# EAGLE design crowlar (EAGLE 8.0.0)
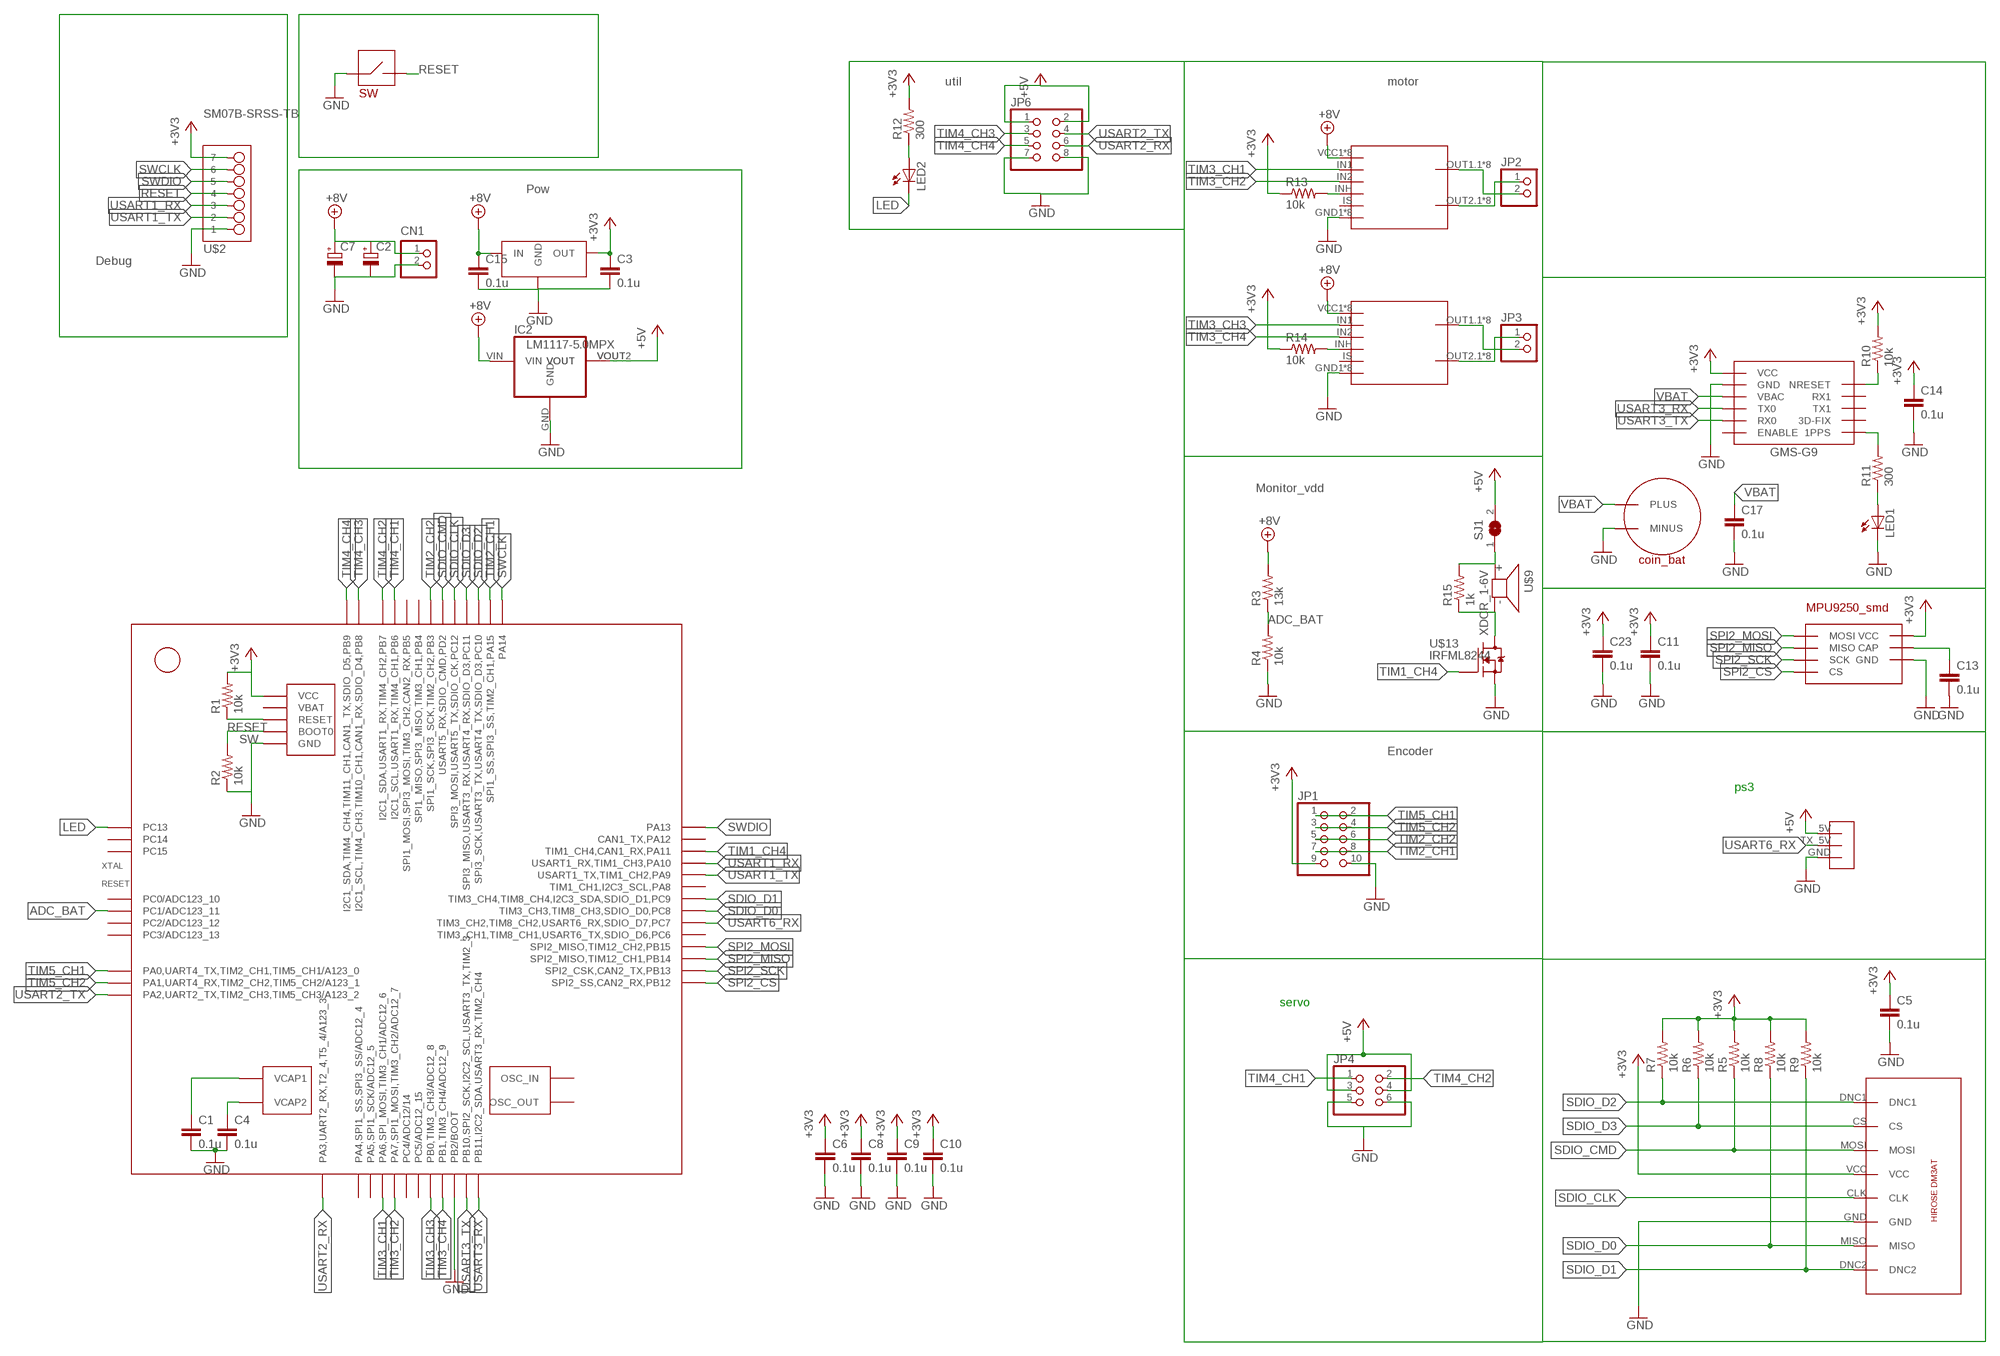
[diagram p0: schematic, sheet 1]

## Parts
C1  0.1u  C-EUC0603K  [C0603K]
C2  CPOL-EU153CLV-0605  [153CLV-0605]
C3  0.1u  C-EUC0603K  [C0603K]
C4  0.1u  C-EUC0603K  [C0603K]
C5  0.1u  C-EUC0603K  [C0603K]
C6  0.1u  C-EUC0603K  [C0603K]
C7  CPOL-EU153CLV-0605  [153CLV-0605]
C8  0.1u  C-EUC0603K  [C0603K]
C9  0.1u  C-EUC0603K  [C0603K]
C10  0.1u  C-EUC0603K  [C0603K]
C11  0.1u  C-EUC0603K  [C0603K]
C13  0.1u  C-EUC0603K  [C0603K]
C14  0.1u  C-EUC0603K  [C0603K]
C15  0.1u  C-EUC0603K  [C0603K]
C17  0.1u  C-EUC0603K  [C0603K]
C23  0.1u  C-EUC0603K  [C0603K]
CN1  S2B-XASK-1  [S2B-XASK-1]
IC2  LM1117-5.0MPX  LM1117-5.0IMP  [SOT223]
JP1  PINHD-2X5/90  [2X05/90]
JP2  PINHD-1X2/90  [1X02/90]
JP3  PINHD-1X2/90  [1X02/90]
JP4  PINHD-2X3/90  [2X03/90]
JP6  PINHD-2X4/90  [2X04/90]
LED1  LEDCHIP-LED0603  [CHIP-LED0603]
LED2  LEDCHIP-LED0603  [CHIP-LED0603]
R1  10k  R-US_R0603  [R0603]
R2  10k  R-US_R0603  [R0603]
R3  13k  R-US_R0603  [R0603]
R4  10k  R-US_R0603  [R0603]
R5  10k  R-US_R0603  [R0603]
R6  10k  R-US_R0603  [R0603]
R7  10k  R-US_R0603  [R0603]
R8  10k  R-US_R0603  [R0603]
R9  10k  R-US_R0603  [R0603]
R10  10k  R-US_R0603  [R0603]
R11  300  R-US_R0603  [R0603]
R12  300  R-US_R0603  [R0603]
R13  10k  R-US_R0603  [R0603]
R14  10k  R-US_R0603  [R0603]
R15  1k  R-US_R0603  [R0603]
SJ1  SJ  [SJ]
STM32F405RGT6  STM32F405_T  [LQFP64]
U$1  GMS-G9  [GMS-G9]
U$2  SM07B-SRSS-TB  [SM07B-SRSS-TB]
U$3  SBDBT_5V  [SBDBT_5V]
U$4  BTM7752  [BTM7752]
U$5  DM3AT  [DM3AT]
U$6  SWTVBP06-B043CB-B  [SW]
U$8  AP7361-33E  [SOT223]
U$9  XDCR_1-6V  [XDCR_1-6V]
U$10  36-3030-ND  [36-3030-ND]
U$11  BTM7752  [BTM7752]
U$13  IRFML8244  [SOT23]
U$16  MPU9250_SMD  [MPU9250_SMD]

## Nets
+3V3: C3.1 C5.1 C6.1 C8.1 C9.1 C10.1 C11.1 C14.1 C23.1 JP1.9 R1.2 R5.2 R6.2 R7.2 R8.2 R9.2 R10.2 R12.2 R13.1 R14.1 STM32F405RGT6.13(VCC) STM32F405RGT6.19(VCC) STM32F405RGT6.32(VCC) STM32F405RGT6.48(VCC) STM32F405RGT6.64(VCC) U$1.VCC U$2.P$7 U$5.VCC U$8.OUT U$16.RESV(VCC) U$16.VDD(VCC) U$16.VDDIO(VCC)
+5V [VCC]: IC2.VOUT IC2.VOUT2(VOUT) JP4.3 JP4.4 JP6.1 JP6.2 SJ1.2 U$3.5V
+8V: C2.+ C7.+ C15.1 CN1.1 IC2.VIN R3.2 U$4.VCC1(VCC) U$4.VCC2(VCC) U$4.VCC3(VCC) U$4.VCC4(VCC) U$4.VCC5(VCC) U$4.VCC6(VCC) U$4.VCC7(VCC) U$4.VCC8(VCC) U$8.IN U$11.VCC1(VCC) U$11.VCC2(VCC) U$11.VCC3(VCC) U$11.VCC4(VCC) U$11.VCC5(VCC) U$11.VCC6(VCC) U$11.VCC7(VCC) U$11.VCC8(VCC)
ADC_BAT: R3.1 R4.2 STM32F405RGT6.9(PC1/ADC123_11)
GND: C1.2 C2.- C3.2 C4.2 C5.2 C6.2 C7.- C8.2 C9.2 C10.2 C11.2 C13.2 C14.2 C15.2 C17.2 C23.2 CN1.2 IC2.GND JP1.10 JP4.5 JP4.6 JP6.7 JP6.8 LED1.C R2.1 R4.1 STM32F405RGT6.12(GND) STM32F405RGT6.18(GND) STM32F405RGT6.28(PB2/BOOT) STM32F405RGT6.63(GND) U$1.GND U$1.GND1(GND) U$2.P$1 U$3.GND U$4.GND1(GND) U$4.GND2(GND) U$4.GND3(GND) U$4.GND4(GND) U$4.GND5(GND) U$4.GND6(GND) U$4.GND7(GND) U$4.GND8(GND) U$5.GND U$6.P$1 U$8.GND1(GND) U$8.GND2(GND) U$10.MINUS U$11.GND1(GND) U$11.GND2(GND) U$11.GND3(GND) U$11.GND4(GND) U$11.GND5(GND) U$11.GND6(GND) U$11.GND7(GND) U$11.GND8(GND) U$13.2(S) U$16.GND U$16.~RESV(GND)
LED: LED2.C STM32F405RGT6.2(PC13)
N$1: JP2.1 U$4.OUT2.1(OUT2) U$4.OUT2.2(OUT2) U$4.OUT2.3(OUT2) U$4.OUT2.4(OUT2) U$4.OUT2.5(OUT2) U$4.OUT2.6(OUT2) U$4.OUT2.7(OUT2) U$4.OUT2.8(OUT2)
N$2: R14.2 U$11.INH
N$3: R13.2 U$4.INH
N$4: JP2.2 U$4.OUT1.1(OUT1) U$4.OUT1.2(OUT1) U$4.OUT1.3(OUT1) U$4.OUT1.4(OUT1) U$4.OUT1.5(OUT1) U$4.OUT1.6(OUT1) U$4.OUT1.7(OUT1) U$4.OUT1.8(OUT1)
N$5: C4.1 STM32F405RGT6.47(VCAP2)
N$6: C1.1 STM32F405RGT6.31(VCAP1)
N$7: R15.2 SJ1.1 U$9.PLUS
N$8: R15.1 U$9.MINUS U$13.3(D)
N$9: JP3.2 U$11.OUT1.1(OUT1) U$11.OUT1.2(OUT1) U$11.OUT1.3(OUT1) U$11.OUT1.4(OUT1) U$11.OUT1.5(OUT1) U$11.OUT1.6(OUT1) U$11.OUT1.7(OUT1) U$11.OUT1.8(OUT1)
N$10: R10.1 U$1.NRESET
N$11: R11.2 U$1.1PPS
N$12: LED1.A R11.1
N$16: LED2.A R12.1
N$17: JP3.1 U$11.OUT2.1(OUT2) U$11.OUT2.2(OUT2) U$11.OUT2.3(OUT2) U$11.OUT2.4(OUT2) U$11.OUT2.5(OUT2) U$11.OUT2.6(OUT2) U$11.OUT2.7(OUT2) U$11.OUT2.8(OUT2)
N$23: C13.1 U$16.REGOUT(CAP)
RESET: R1.1 STM32F405RGT6.7(RESET) U$2.P$4 U$6.P$2
SDIO_CLK: STM32F405RGT6.53(SPI3_MOSI,USART5_TX,SDIO_CK,PC12) U$5.CLK
SDIO_CMD: R5.1 STM32F405RGT6.54(USART5_RX,SDIO_CMD,PD2) U$5.MOSI
SDIO_D0: R8.1 STM32F405RGT6.39(TIM3_CH3,TIM8_CH3,SDIO_D0,PC8) U$5.MISO
SDIO_D1: R9.1 STM32F405RGT6.40(TIM3_CH4,TIM8_CH4,I2C3_SDA,SDIO_D1,PC9) U$5.DNC2
SDIO_D2: R7.1 STM32F405RGT6.51(SPI3_SCK,USART3_TX,USART4_TX,SDIO_D3,PC10) U$5.DNC1
SDIO_D3: R6.1 STM32F405RGT6.52(SPI3_MISO,USART3_RX,USART4_RX,SDIO_D3,PC11) U$5.CS
SPI2_CS: STM32F405RGT6.33(SPI2_SS,CAN2_RX,PB12) U$16.CS
SPI2_MISO: STM32F405RGT6.35(SPI2_MISO,TIM12_CH1,PB14) U$16.MISO
SPI2_MOSI: STM32F405RGT6.36(SPI2_MISO,TIM12_CH2,PB15) U$16.MOSI
SPI2_SCK: STM32F405RGT6.34(SPI2_CSK,CAN2_TX,PB13) U$16.SCK
SW: R2.2 STM32F405RGT6.60(BOOT0)
SWCLK: STM32F405RGT6.49(PA14) U$2.P$6
SWDIO: STM32F405RGT6.46(PA13) U$2.P$5
TIM1_CH4: STM32F405RGT6.44(TIM1_CH4,CAN1_RX,PA11) U$13.1(G)
TIM2_CH1: JP1.7 JP1.8 STM32F405RGT6.50(SPI1_SS,SPI3_SS,TIM2_CH1,PA15)
TIM2_CH2: JP1.5 JP1.6 STM32F405RGT6.55(SPI1_SCK,SPI3_SCK,TIM2_CH2,PB3)
TIM3_CH1: STM32F405RGT6.22(PA6,SPI_MOSI,TIM3_CH1/ADC12_6) U$4.IN1
TIM3_CH2: STM32F405RGT6.23(PA7,SPI1_MOSI,TIM3_CH2/ADC12_7) U$4.IN2
TIM3_CH3: STM32F405RGT6.26(PB0,TIM3_CH3/ADC12_8) U$11.IN1
TIM3_CH4: STM32F405RGT6.27(PB1,TIM3_CH4/ADC12_9) U$11.IN2
TIM4_CH1: JP4.1 STM32F405RGT6.58(I2C1_SCL,USART1_RX,TIM4_CH1,PB6)
TIM4_CH2: JP4.2 STM32F405RGT6.59(I2C1_SDA,USART1_RX,TIM4_CH2,PB7)
TIM4_CH3: JP6.3 STM32F405RGT6.61(I2C1_SCL,TIM4_CH3,TIM10_CH1,CAN1_RX,SDIO_D4,PB8)
TIM4_CH4: JP6.5 STM32F405RGT6.62(I2C1_SDA,TIM4_CH4,TIM11_CH1,CAN1_TX,SDIO_D5,PB9)
TIM5_CH1: JP1.1 JP1.2 STM32F405RGT6.14(PA0,UART4_TX,TIM2_CH1,TIM5_CH1/A123_0)
TIM5_CH2: JP1.3 JP1.4 STM32F405RGT6.15(PA1,UART4_RX,TIM2_CH2,TIM5_CH2/A123_1)
USART1_RX: STM32F405RGT6.43(USART1_RX,TIM1_CH3,PA10) U$2.P$3
USART1_TX: STM32F405RGT6.42(USART1_TX,TIM1_CH2,PA9) U$2.P$2
USART2_RX: JP6.6 STM32F405RGT6.17(PA3,UART2_RX,T2_4,T5_4/A123_3)
USART2_TX: JP6.4 STM32F405RGT6.16(PA2,UART2_TX,TIM2_CH3,TIM5_CH3/A123_2)
USART3_RX: STM32F405RGT6.30(PB11,I2C2_SDA,USART3_RX,TIM2_CH4) U$1.TX0
USART3_TX: STM32F405RGT6.29(PB10,SPI2_SCK,I2C2_SCL,USART3_TX,TIM2_3) U$1.RX0
USART6_RX: STM32F405RGT6.38(TIM3_CH2,TIM8_CH2,USART6_RX,SDIO_D7,PC7) U$3.TX_5V
VBAT: C17.1 U$1.VBAC U$10.PLUS1(PLUS) U$10.PLUS2(PLUS)
Unconnected: STM32F405RGT6.1(VBAT) STM32F405RGT6.3(PC14) STM32F405RGT6.4(PC15) STM32F405RGT6.5(OSC_IN) STM32F405RGT6.6(OSC_OUT) STM32F405RGT6.8(PC0/ADC123_10) STM32F405RGT6.10(PC2/ADC123_12) STM32F405RGT6.11(PC3/ADC123_13) STM32F405RGT6.20(PA4,SPI1_SS,SPI3_SS/ADC12_4) STM32F405RGT6.21(PA5,SPI1_SCK/ADC12_5) STM32F405RGT6.24(PC4/ADC12/14) STM32F405RGT6.25(PC5/ADC12_15) STM32F405RGT6.37(TIM3_CH1,TIM8_CH1,USART6_TX,SDIO_D6,PC6) STM32F405RGT6.41(TIM1_CH1,I2C3_SCL,PA8) STM32F405RGT6.45(CAN1_TX,PA12) STM32F405RGT6.56(SPI1_MISO,SPI3_MISO,TIM3_CH1,PB4) STM32F405RGT6.57(SPI1_MOSI,SPI3_MOSI,TIM3_CH2,CAN2_RX,PB5) U$1.3D-FIX U$1.ENABLE U$1.RX1 U$1.TX1 U$4.IS U$11.IS

## Notes on the sheet
- util | motor
- Pow
- Debug
- Monitor_vdd
- Encoder
- ps3
- servo

## Library data of the parts
C1 C3-C6 C8-C11 C13-C15 C17 C23 = resistor:C-EU: CAPACITOR, European symbol
C2 C7 = rcl:CPOL-EU: POLARIZED CAPACITOR, European symbol
CN1 = jst-xa:S2B-XASK-1: Wire-to-Board 2.5mm pitch top mount connector Source: http://www.jst-mfg.com/product/pdf/jpn/XA1.pdf http://www.jst-mfg.com/product/detail.php?series=272
IC2 = Regulator:LM1117: 800mA and 1A Low Dropout (LDO) Positive Regulator 1.8V, 2.5V, 2.85V, 3.3V, 5V, and Adj
JP1 = pinhead:PINHD-2X5: PIN HEADER
JP2 JP3 = pinhead:PINHD-1X2: PIN HEADER
JP4 = pinhead:PINHD-2X3: PIN HEADER
JP6 = pinhead:PINHD-2X4: PIN HEADER
LED1 LED2 = led:LED: LED OSRAM: - CHIPLED LG R971, LG N971, LY N971, LG Q971, LY Q971, LO R971, LY R971 LH N974, LH R974 LS Q976, LO Q976, LY Q976 LO Q996 - Hyper CHIPLED LW Q18S LB Q993, LB Q99A, LB R99A - SideLED LS A670, LO A670, LY A670, LG A670, LP A670 LB A673, LV A673, LT A673, LW A673 LH A674 LY A675 LS A676, LA A676, LO A676, LY A676, LW A676 LS A679, LY A679, LG A679 - Hyper Micro SIDELED® LS Y876, LA Y876, LO Y876, LY Y876 LT Y87S - SmartLED LW L88C, LW L88S LB L89C, LB L89S, LG L890 LS L89K, LO L89K, LY L89K LS L896, LA L896, LO L896, LY L896 - TOPLED LS T670, LO T670, LY T670, LG T670, LP T670 LSG T670, LSP T670, LSY T670, LOP T670, LYG T670 LG T671, LOG T671, LSG T671 LB T673, LV T673, LT T673, LW T673 LH T674 LS T676, LA T676, LO T676, LY T676, LB T676, LH T676, LSB T676, LW T676 LB T67C, LV T67C, LT T67C, LS T67K, LO T67K, LY T67K, LW E67C LS E67B, LA E67B, LO E67B, LY E67B, LB E67C, LV E67C, LT E67C LW T67C LS T679, LY T679, LG T679 LS T770, LO T770, LY T770, LG T770, LP T770 LB T773, LV T773, LT T773, LW T773 LH T774 LS E675, LA E675, LY E675, LS T675 LS T776, LA T776, LO T776, LY T776, LB T776 LHGB T686 LT T68C, LB T68C - Hyper Mini TOPLED® LB M676 - Mini TOPLED Santana® LG M470 LS M47K, LO M47K, LY M47K Source: http://www.osram.convergy.de LUXEON: - LUMILED® LXK2-PW12-R00, LXK2-PW12-S00, LXK2-PW14-U00, LXK2-PW14-V00 LXK2-PM12-R00, LXK2-PM12-S00, LXK2-PM14-U00 LXK2-PE12-Q00, LXK2-PE12-R00, LXK2-PE12-S00, LXK2-PE14-T00, LXK2-PE14-U00 LXK2-PB12-K00, LXK2-PB12-L00, LXK2-PB12-M00, LXK2-PB14-N00, LXK2-PB14-P00, LXK2-PB14-Q00 LXK2-PR12-L00, LXK2-PR12-M00, LXK2-PR14-Q00, LXK2-PR14-R00 LXK2-PD12-Q00, LXK2-PD12-R00, LXK2-PD12-S00 LXK2-PH12-R00, LXK2-PH12-S00 LXK2-PL12-P00, LXK2-PL12-Q00, LXK2-PL12-R00 Source: www.luxeon.com KINGBRIGHT: KA-3528ASYC Source: www.kingbright.com
R1-R15 = resistor:R-US_: RESISTOR, American symbol
SJ1 = jumper:SJ: SMD solder JUMPER
STM32F405RGT6 = stm32f:STM32F405_T
U$1 = GMS-G9:GMS-G9
U$2 = con-jst-sh:SM07B-SRSS-TB
U$3 = SBDBT_5V:SBDBT_5V
U$4 U$11 = BTM7752:BTM7752
U$5 = HIROSE-DM3AT:DM3AT
U$6 = TVBP06-B043CB-B:SW
U$8 = AP7361-33E:AP7361-33E
U$9 = buzzer:XDCR_1-6V
U$10 = 36-3030-ND:36-3030-ND
U$13 = transistor-fet:IRFML8244
U$16 = MPU9250:MPU9250_SMD

## Board
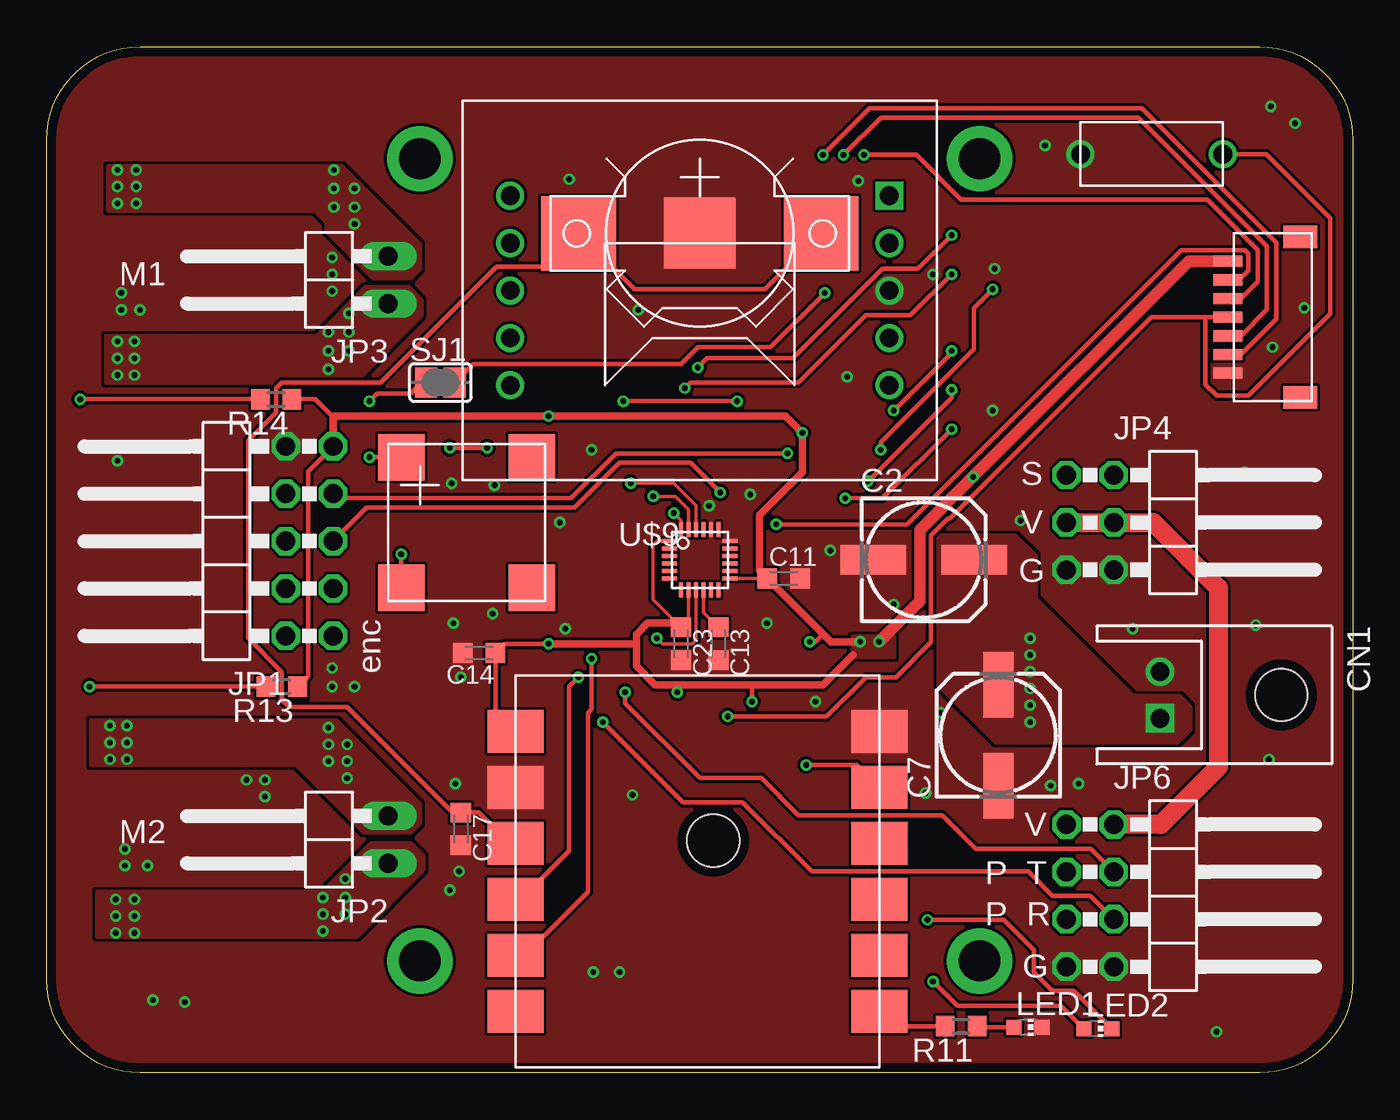
[diagram p1: board, top side]
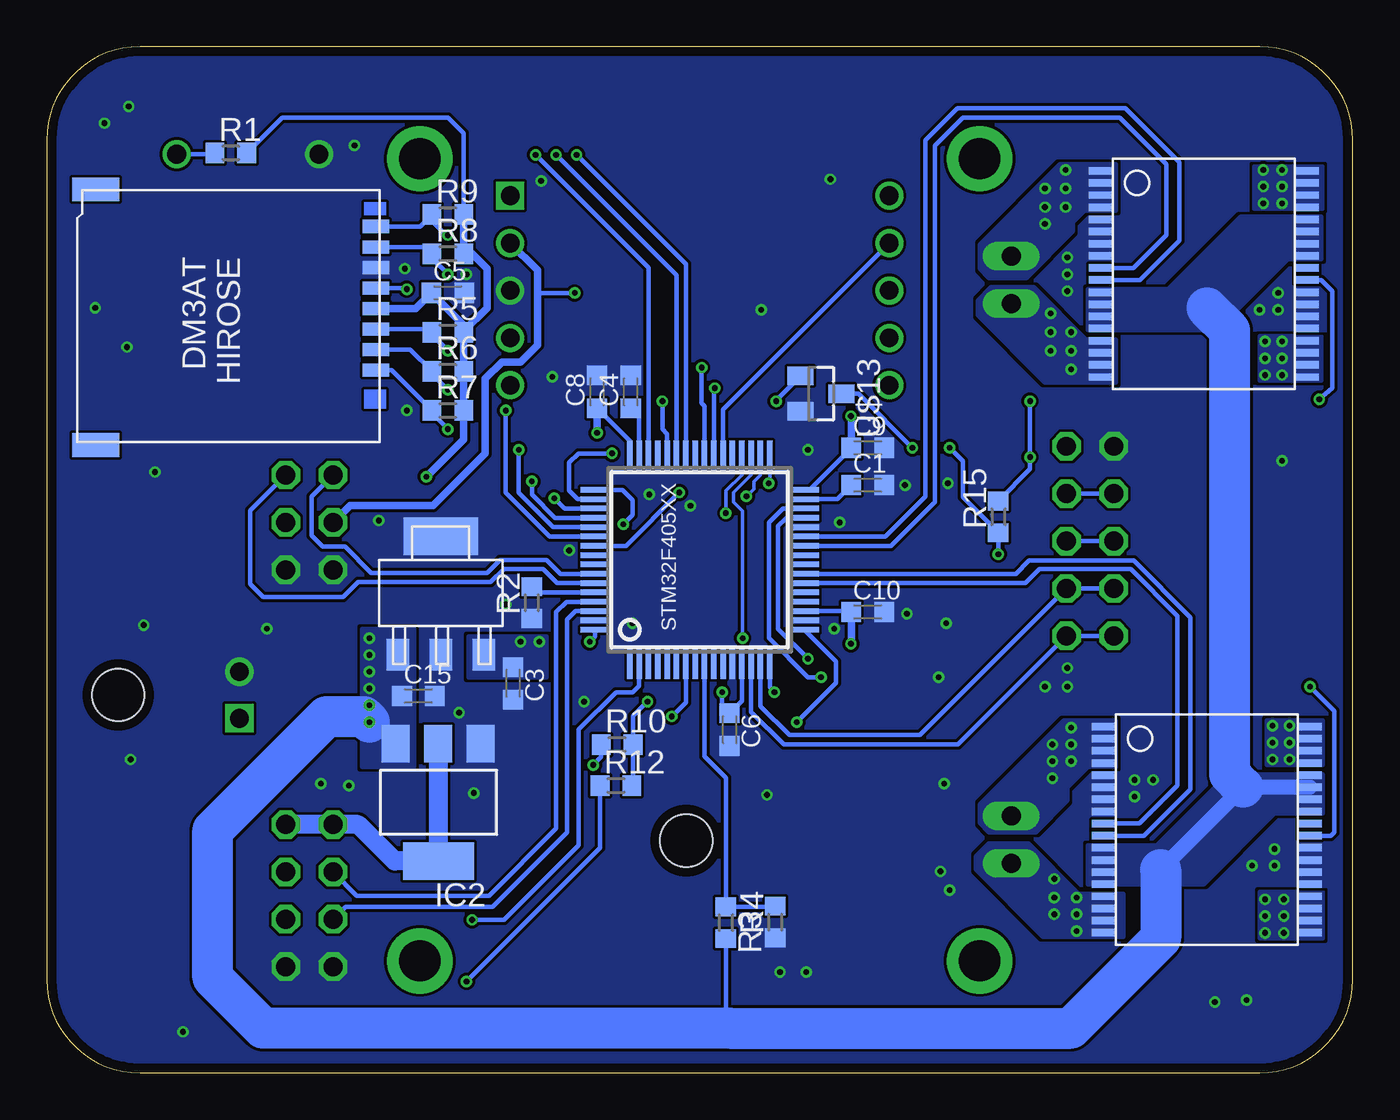
[diagram p2: board, bottom side, seen from below]

Size 70 x 55 mm. Coordinates in mm from the lower left corner, seen from the top.
Outline: 0,50 arc-90 5,55 65,55 arc-90 70,50 70,5 arc-90 65,0 5,0 arc-90 0,5 0,50
Copper layers (1*16): Top 0.035mm / dielectric 1.6mm / Bottom 0.035mm
Design rules "Elecrow_2-layer_PCB_eagle_rule": minimum track width 6mil, minimum drill 12mil, track to track 6mil, track to pad 6mil, pad to pad 6mil, via to via 8mil, smd to smd 0mil, copper to edge 20mil, drill to drill 10mil, minimum pad ring 6mil, minimum via ring 6mil, stop-mask expansion 0mil, vias tented up to drill 100mil, thermal gap 10mil

### Footprints (pad centres in the part's own frame; a part is rotated, then mirrored left to right if it is on the bottom)
C0603K = smd 1.05 x 1.08: 1 -0.875,0; 2 0.875,0
153CLV-0605 = smd 3.5 x 1.6: + 2.7,0; - -2.7,0
S2B-XASK-1 = drill 1.016 square: 1 1.25,0 | drill 1.016: 2 -1.25,0 | hole 2.8: 0,6.5
SOT223 = smd 1.499 x 2.007: GND -2.261,-3.15; VIN 2.311,-3.15; VOUT 0.025,-3.15 | smd 3.81 x 2.007: VOUT2 0,3.15
2X05/90 = drill 1.016 octagon: 1 -5.08,-6.35; 2 -5.08,-3.81; 3 -2.54,-6.35; 4 -2.54,-3.81; 5 0,-6.35; 6 0,-3.81; 7 2.54,-6.35; 8 2.54,-3.81; 9 5.08,-6.35; 10 5.08,-3.81
1X02/90 = drill 1.016 long: 1 -1.27,-3.81; 2 1.27,-3.81
2X03/90 = drill 1.016 octagon: 1 -2.54,-6.35; 2 -2.54,-3.81; 3 0,-6.35; 4 0,-3.81; 5 2.54,-6.35; 6 2.54,-3.81
2X04/90 = drill 1.016 octagon: 1 -3.81,-6.35; 2 -3.81,-3.81; 3 -1.27,-6.35; 4 -1.27,-3.81; 5 1.27,-6.35; 6 1.27,-3.81; 7 3.81,-6.35; 8 3.81,-3.81
CHIP-LED0603 = smd 0.8 x 0.8: A 0,-0.75; C 0,0.75
R0603 = smd 1 x 1.1: 1 -0.85,0; 2 0.85,0
SJ = smd 1.168 x 1.6: 1 -0.762,0; 2 0.762,0
LQFP64 = smd 1.6 x 0.3: 1 -5.6,3.75; 2 -5.6,3.25; 3 -5.6,2.75; 4 -5.6,2.25; 5 -5.6,1.75; 6 -5.6,1.25; 7 -5.6,0.75; 8 -5.6,0.25; 9 -5.6,-0.25; 10 -5.6,-0.75; 11 -5.6,-1.25; 12 -5.6,-1.75; 13 -5.6,-2.25; 14 -5.6,-2.75; 15 -5.6,-3.25; 16 -5.6,-3.75; 33 5.6,-3.75; 34 5.6,-3.25; 35 5.6,-2.75; 36 5.6,-2.25; 37 5.6,-1.75; 38 5.6,-1.25; 39 5.6,-0.75; 40 5.6,-0.25; 41 5.6,0.25; 42 5.6,0.75; 43 5.6,1.25; 44 5.6,1.75; 45 5.6,2.25; 46 5.6,2.75; 47 5.6,3.25; 48 5.6,3.75 | smd 0.3 x 1.6: 17 -3.75,-5.6; 18 -3.25,-5.6; 19 -2.75,-5.6; 20 -2.25,-5.6; 21 -1.75,-5.6; 22 -1.25,-5.6; 23 -0.75,-5.6; 24 -0.25,-5.6; 25 0.25,-5.6; 26 0.75,-5.6; 27 1.25,-5.6; 28 1.75,-5.6; 29 2.25,-5.6; 30 2.75,-5.6; 31 3.25,-5.6; 32 3.75,-5.6; 49 3.75,5.6; 50 3.25,5.6; 51 2.75,5.6; 52 2.25,5.6; 53 1.75,5.6; 54 1.25,5.6; 55 0.75,5.6; 56 0.25,5.6; 57 -0.25,5.6; 58 -0.75,5.6; 59 -1.25,5.6; 60 -1.75,5.6; 61 -2.25,5.6; 62 -2.75,5.6; 63 -3.25,5.6; 64 -3.75,5.6
GMS-G9 = smd 3 x 2.3: 1PPS 9.75,-6; 3D-FIX 9.75,-3; ENABLE -9.75,-6; GND -9.75,6; GND1 9.75,9; NRESET 9.75,6; RX0 -9.75,-3; RX1 9.75,3; TX0 -9.75,0; TX1 9.75,0; VBAC -9.75,3; VCC -9.75,9 | hole 2.8: 0.85,3.15
SM07B-SRSS-TB = smd 0.6 x 1.55: P$1 -3,0; P$2 -2,0; P$3 -1,0; P$4 0,0; P$5 1,0; P$6 2,0; P$7 3,0 | smd 1.2 x 1.8: P$8 -4.3,-3.875; P$9 4.3,-3.875
SBDBT_5V = drill 1 square: 1 10.16,5.08 | drill 1: 4 10.16,-2.54; 5 10.16,-5.08; 5V 10.16,2.54; 6 -10.16,5.08; 8 -10.16,0; 9 -10.16,-2.54; 10 -10.16,-5.08; GND 10.16,0; TX_5V -10.16,2.54
BTM7752 = smd 1.27 x 0.4: GND1 -5.2,3.25; GND2 -5.2,2.6; GND3 -5.2,1.95; GND4 -5.2,1.3; GND5 5.85,-0.65; GND6 5.85,-1.3; GND7 5.85,-1.95; GND8 5.85,-2.6; IN1 -5.2,0.65; IN2 -5.2,0; INH 5.85,0; IS 5.85,0.65; OUT1.1 -5.2,5.85; OUT1.2 -5.2,5.2; OUT1.3 -5.2,4.55; OUT1.4 -5.2,3.9; OUT1.5 5.85,5.85; OUT1.6 5.85,5.2; OUT1.7 5.85,4.55; OUT1.8 5.85,3.9; OUT2.1 -5.2,-3.25; OUT2.2 -5.2,-3.9; OUT2.3 -5.2,-4.55; OUT2.4 -5.2,-5.2; OUT2.5 5.85,-3.25; OUT2.6 5.85,-3.9; OUT2.7 5.85,-4.55; OUT2.8 5.85,-5.2; VCC1 -5.2,-0.65; VCC2 -5.2,-1.3; VCC3 -5.2,-1.95; VCC4 -5.2,-2.6; VCC5 5.85,3.25; VCC6 5.85,2.6; VCC7 5.85,1.95; VCC8 5.85,1.3
DM3AT = smd 0.711 x 1.422: CLK -1.56,6.63; CS 1.74,6.63; DNC1 2.84,6.63; DNC2 -4.86,6.63; GND -2.66,6.63; MISO -3.76,6.63; MOSI 0.64,6.63; VCC -0.46,6.63 | smd 1.27 x 2.54: P$1 6.85,-8.39; P$2 -6.85,-8.39
SW = drill 1: P$1 -3.81,0; P$2 3.81,0
SOT223' = smd 4 x 2: GND1 0,3.81 | smd 1.2 x 1.7: GND2 0,-2.54; IN -2.3,-2.54; OUT 2.3,-2.54
XDCR_1-6V = smd 2.5 x 2.5: MINUS 3.5,3.5; P$1 -3.5,3.5; P$2 -3.5,-3.5; PLUS 3.5,-3.5
36-3030-ND = smd 3.81 x 3.81: MINUS 0,0 | smd 4 x 4: PLUS1 -6.5,0; PLUS2 6.5,0
SOT23 = smd 1 x 1.4: 1 -0.95,-1.1; 2 0.95,-1.1; 3 0,1.1
MPU9250_SMD = smd 0.2 x 0.8: AUX_CL -1,-1.62; AUX_DA 0.2,1.62; CS -0.2,1.62; FSYNC 0.6,-1.62; INT 1,-1.62; MISO -0.2,-1.62; MOSI -1,1.62; NC9 1,1.62; REGOUT 0.2,-1.62; SCK -0.6,1.62; VDDIO -0.6,-1.62; ~RESV 0.6,1.62 | smd 0.8 x 0.2: GND 1.62,1; NC0 -1.62,0.6; NC1 -1.62,0.2; NC2 -1.62,-0.2; NC3 -1.62,-0.6; NC4 -1.62,-1; NC5 1.62,-0.6; NC6 1.62,-0.2; NC7 1.62,0.2; NC8 1.62,0.6; RESV -1.62,1; VDD 1.62,-1

### Placement (x,y rotation side)
C1  26,31.5 0 bottom
C2  47,27.5 0 top
C3  45,20.88 270 bottom
C4  38.7,36.5 90 bottom
C5  48.5,41.8 0 bottom
C6  33.4,18.4 270 bottom
C7  51,18.1 90 top
C8  40.5,36.5 90 bottom
C9  26,33.5 0 bottom
C10  26,24.7 0 bottom
C11  39.5,26.5 0 top
C13  36,23 270 top
C14  23.18,22.5 180 top
C15  50.08,20.2 0 bottom
C17  22.2,13.07 270 top
C23  34,23 270 top
CN1  59.67,20.25 270 top
IC2  49,14.5 180 bottom
JP1  9,28.5 90 top
JP2  14.5,12.5 90 top
JP3  14.5,42.5 90 top
JP4  61,29.5 270 top
JP6  61,9.5 270 top
LED1  52.58,2.45 270 top
LED2  56.33,2.37 270 top
R1  60.13,49.3 0 bottom
R2  44,25.2 90 bottom
R3  33.6,8.05 270 bottom
R4  30.95,8.09 90 bottom
R5  48.5,39.7 0 bottom
R6  48.5,37.6 0 bottom
R7  48.5,35.5 0 bottom
R8  48.5,43.9 0 bottom
R9  48.5,46 0 bottom
R10  39.43,17.6 0 bottom
R11  49.01,2.5 180 top
R12  39.49,15.4 0 bottom
R13  12.6,20.7 180 top
R14  12.3,36.1 180 top
R15  19,29.8 90 bottom
SJ1  21.1,37 0 top
STM32F405RGT6  35,27.5 90 bottom
U$1  34.87,9.3 0 top
U$2  63.31,40.5 90 top
U$3  35,41.93 0 top
U$4  8.15,12.71 0 bottom
U$5  58.98,40.5 270 bottom
U$6  59.22,49.24 0 top
U$8  AP7361-33E  [SOT223']  48.88,24.95 0 bottom
U$9  22.5,29.5 180 top
U$10  35,45 0 top
U$11  8.32,42.49 0 bottom
U$13  28.5,36.4 270 bottom
U$16  35,27.5 0 top

### Tracks (layer width: path | path; a pad name or v marks a point on that pad's centre or on a via)
+3V3  (via drill 0.3)
  Top 0.2: U$16.VDDIO 34.4,24.27 C23.1 32.5,25.38 32.5,28.3 32.7,28.5 U$16.RESV | U$16.VDD C11.1
  Top 0.254: v40.9,23.1 41.2,23.1 41.61,23.51 | R14.1 14.4,36.1 15.35,35.15 | v37.8,19.9 37.8,20.8 | R13.1 14,21.25 14,32.23 JP1.9 | U$1.VCC 24.05,19.37 C14.1 24.55,23 v26.9,23
  Top 0.406: v43.6,23.1 42.02,23.1 41.61,23.51 C11.1 38.2,26.93 38.2,29.9 40.5,32.2 v40.5,34.3 39.6,35.2 v26.9,35.2 15.4,35.2 15.35,35.15 JP1.9 | C23.1 33.77,24.1 32.2,24.1 31.6,23.5 31.6,23.1 | 31.6,23.1 31.6,21.8 32.6,20.8 33.9,20.8 | 43.2,22.4 41.6,20.8 37.8,20.8 33.9,20.8 | v33.8,20.4 33.8,20.7 33.9,20.8 | v26.9,23 31.5,23 31.6,23.1
  Top 0.61: U$2.P$7 61.2,43.5 v49.65,31.95 46.8,29.1 46.8,25.3 v44.6,23.1
  Bottom 0.254: R1.2 57.38,51.2 48.5,51.2 47.65,50.35 R9.2 | STM32F405RGT6.64 40.6,23.4 v40.9,23.1 | C8.1 38.75,33.88 STM32F405RGT6.48 | C9.1 29.12,31.25 STM32F405RGT6.32 | STM32F405RGT6.19 26.93,24.75 C10.1 | R12.2 38.58,15.46 R10.2 38.58,19.12 v37.8,19.9 | v33.8,20.4 33.8,19.68 C6.1 32.75,19.93 STM32F405RGT6.13
  Bottom 0.406: U$5.VCC 50.22,40.96 C5.1 47.65,40.08 R5.2 | R5.2 R6.2 R7.2 47.65,33.95 v49.65,31.95 | R9.2 R8.2 47.2,43.9 46.4,43.1 46.4,41 47.65,39.75 R5.2 | v40.5,34.3 C8.1 | 26.9,33.5 C9.1 26.88,35.17 v26.9,35.2 | C10.1 26.88,23.02 v26.9,23
  pour Bottom (no thermals): 47.4,23.4 47.4,21.2 43.2,21.2 43.2,23.4
  pour Top (no thermals): 43.2,23.4 43.2,22.3 45.4,22.3 45.4,23.4
+5V  (via drill 0.3)
  Top 0.254: SJ1.2 22.86,38 34,38 34.9,38.9 38.8,38.9 v41.7,41.8
  Top 1.016: JP4.3 JP4.4 59.3,29.5 62.8,26 62.8,16.4 59.71,13.31 JP6.2
  Bottom 0.254: v41.7,41.8 43.7,41.8
  Bottom 0.406: U$3.5V 43.7,43.01 43.7,41.8 43.7,39 44.6,38.1 45.6,38.1 46.5,37.2 46.5,33.2 49.3,30.4 53.75,30.4 JP4.3
  Bottom 1.016: IC2.VOUT 49.02,11.22 48.7,10.9 48.7,11.05 IC2.VOUT2 51.35,11.35 53.31,13.31 JP6.1 JP6.2
+8V  (via drill 0.3)
  Bottom 0.254: R3.2 33.6,2.6 33.4,2.4
  Bottom 0.813: U$4.VCC6 5.89,15.31 10.3,10.9
  Bottom 2.184: 10.3,10.9 10.3,7.2 15.1,2.4 33.4,2.4 58.4,2.4 61.1,5.1 61.1,13 55,19.1 53,19.1 v52.7,18.8 | 5.89,15.31 6.6,16.02 6.6,39.8 7.8,41
  other vias: 52.7,23.3 52.7,22.4 52.7,21.5 52.7,20.6 52.7,19.7
  pour Top (no thermals): 47.8,28.8 51.9,28.8 53,27.7 53,25.4 58.2,20.2 60.7,20.2 61.3,19.6 61.3,18.4 60.6,17.7 50.9,17.7 47.8,20.8
  pour Bottom (no thermals): 50.3,23.8 50.3,16.4 53.1,16.4 53.1,23.8
  pour Bottom (no thermals): 1.6,16 6.7,16 10.5,12.2 14.2,12.2 14.2,10.1 8,10.1 4.2,13.9 1.6,13.9
  pour Bottom (no thermals): 1.7,45.9 6,45.9 9.9,42 14.2,42 14.2,39.8 7.3,39.8 3.5,43.6 1.7,43.6
ADC_BAT
  Bottom 0.254: STM32F405RGT6.9 34.75,16.95 33.6,15.8 R3.1 30.99,8.9 R4.2
GND  (via drill 0.3)
  other vias: 31.7,40.9 47.5,42.8 52.2,29.6 42,28 45.4,25.1 38.6,24.1 37.7,31 41.2,19.9 24,31.5 27.5,29.5 21.7,31.6 27.8,23.8 23.9,24.6 21.8,24.1 29.2,33.4 5,40.9 16.5,20.7 15.3,43.7 15.3,42.8 15.3,41.9 4,41.8 4,40.9 3.8,32.8 11.7,15.7 11.7,14.8 10.7,15.7 4.2,12 4.2,11.1 5.4,11.1 5.7,3.9 7.4,3.8 21.6,9.8 22.1,10.8 21.9,15.5 22.2,21.2 29.3,5.4 30.7,5.4 31.4,14.9 62.7,2.2 58.2,23.8 64.8,24 65.5,16.8 55.3,15.5 53.8,15.4 47.1,15 50.7,35.5 64.2,32.2 53.5,49.7 42.9,37.3 35.5,30.4 28,47.9 43.5,47.8 67.4,41 65.7,38.9 50.8,43.1 15.3,20.7 15.3,21.7 47.9,19.3 65.6,51.8 66.9,50.9
  pour Top (rank 6, no thermals): -5,55.5 73,55.5 73,-3.5 -5,-3.5
  pour Bottom (rank 6, no thermals): -9.9,57.7 80.1,57.7 80,-6.5 -10,-6.5
LED  (via drill 0.3)
  Top 0.254: LED2.C 55.05,4.4 53.9,4.4 52.9,5.4 52.9,6.6 51.3,8.2 v47.2,8.2
  Bottom 0.254: v47.2,8.2 45.5,8.2 41.5,12.2 41.5,18.4 39.5,20.4 38.6,20.4 38.25,20.75 STM32F405RGT6.2
N$1  (via drill 0.3)
  other vias: 4.7,9.3 4.7,8.4 4.7,7.5 3.7,9.3 3.7,8.4 3.7,7.5 14.8,9.4 14.8,8.5 14.8,7.6 16,9.4 16,10.4 16,8.5
  pour Bottom (no thermals): 12.3,9.6 14.7,9.6 17.4,12.3 19.5,12.3 20.2,11.6 20.2,10.9 16.6,7.3 12.3,7.3
  pour Bottom (no thermals): 1.6,9.7 5,9.7 5,7.2 1.6,7.2
  pour Top (no thermals): 2.7,9.7 14.8,9.7 17.4,12.3 19.5,12.3 20.2,11.6 20.2,10.9 16.6,7.3 2.7,7.3
N$2  (via drill 0.3)
  Top 0.254: v1.8,36.1 R14.2
  Bottom 0.254: U$11.INH 1.69,42.49 1.1,41.9 1.1,36.7 v1.8,36.1
N$3  (via drill 0.3)
  Top 0.254: v2.3,20.7 R13.2
  Bottom 0.254: U$4.INH 1.19,12.71 1,12.9 1,19.4 v2.3,20.7
N$4  (via drill 0.3)
  other vias: 4.3,18.6 4.3,17.7 4.3,16.8 3.4,18.6 3.4,17.7 3.4,16.8 15.1,18.5 15.1,17.6 15.1,16.7 16.1,17.6 16.1,16.7 16.1,15.8
  pour Bottom (no thermals): 12.7,18.9 15.5,18.9 20,14.4 20,13.4 19.5,12.9 17,12.9 15.3,14.6 15.3,15.3 14.2,16.4 12.7,16.4
  pour Bottom (no thermals): 1.6,18.9 4.6,18.9 4.6,16.5 1.6,16.5
  pour Top: 2.4,18.9 15.5,18.9 15.5,16.5 2.4,16.5
  pour Top (no thermals): 13.2,18.9 15.5,18.9 20,14.4 20,13.4 19.5,12.9 17,12.9 13.2,16.7
N$5
  Bottom 0.254: C4.1 38.25,35.17 STM32F405RGT6.47
N$6
  Bottom 0.254: C1.1 27.62,30.75 STM32F405RGT6.31
N$7  (via drill 0.3)
  Top 0.254: 18.4,33 U$9.PLUS v17.3,33 | v17.3,36 17.7,36.4 19.5,36.4 20.1,37 SJ1.1
  Bottom 0.254: v17.3,36 v17.3,33 17.3,32.35 R15.2
N$8  (via drill 0.3)
  Top 0.254: U$9.MINUS v19,27.8 | v23.6,33.5 v21.6,33.5
  Bottom 0.254: v19,27.8 R15.1 20.9,30.85 20.9,32.8 v21.6,33.5 | U$13.3 26.5,36.4 v23.6,33.5
N$9  (via drill 0.3)
  other vias: 3.8,48.4 3.8,47.5 3.8,46.6 4.8,48.4 4.8,47.5 4.8,46.6 15.4,48.4 15.4,47.4 15.4,46.4 16.5,47.4 16.5,46.4 16.5,45.5
  pour Bottom (no thermals): 12.7,48.7 15.7,48.7 20,44.4 20,43.1 19.5,42.6 17.5,42.6 15,45.1 15,45.6 14.4,46.2 12.7,46.2
  pour Bottom (no thermals): 1.6,48.6 5.3,48.6 5.3,46.3 1.6,46.3
  pour Top (no thermals): 3.3,48.6 15.8,48.6 20,44.4 20,43.1 19.5,42.6 17.5,42.6 15,45.1 15,45.6 14.4,46.2 3.3,46.2
N$10  (via drill 0.3)
  Top 0.254: v40.7,16.5 43.42,16.5 U$1.NRESET
  Bottom 0.254: R10.1 40.28,16.92 v40.7,16.5
N$11
  Top 0.254: U$1.1PPS 45.42,2.5 R11.2
N$12
  Top 0.254: R11.1 49.91,2.45 LED1.A
N$16  (via drill 0.3)
  Top 0.254: LED2.A 54.35,3.6 48.8,3.6 v47.5,4.9
  Bottom 0.254: R12.1 40.34,12.06 v47.5,4.9
N$17  (via drill 0.3)
  other vias: 3.8,39.2 3.8,38.3 3.8,37.4 4.7,39.2 4.7,38.3 4.7,37.4 15.1,37.7 15.1,38.7 15.1,39.7 16.2,39.7 16.2,38.7 16.2,40.7
  pour Bottom (no thermals): 12.7,39.3 14.3,39.3 17.1,42.1 19.4,42.1 20.1,41.4 20.1,40.6 16.5,37 12.7,37
  pour Bottom (no thermals): 1.7,39.5 5,39.5 5,37.1 1.7,37.1
  pour Top (no thermals): 3.2,39.5 14.5,39.5 17.1,42.1 19.4,42.1 20.1,41.4 20.1,40.6 16.5,37 3.2,37
N$18  (via drill 2.2 pad 3.5)
  other vias: 20,49
N$19  (via drill 2.2 pad 3.5)
  other vias: 20,6
N$20  (via drill 2.2 pad 3.5)
  other vias: 50,6
N$22  (via drill 2.2 pad 3.5)
  other vias: 50,49
N$23
  Top 0.2: U$16.REGOUT 35.2,24.68 C13.1
RESET  (via drill 0.3)
  Top 0.254: 62.1,40.5 U$2.P$4 | 62.1,40.5 59.2,40.5 48.4,29.7 48.3,29.7 47.4,28.8 47.4,23.1 45.5,21.2 43.9,21.2 41.8,19.1 v36.5,19.1 | U$6.P$2 65.36,49.24 68.8,45.8 68.8,40.7 64.4,36.3 62.7,36.3 62.1,36.9 62.1,40.5
  Bottom 0.254: R1.1 61.04,49.24 U$6.P$2 | v36.5,19.1 35.75,19.85 STM32F405RGT6.7
SDIO_CLK  (via drill 0.3)
  Top 0.254: v50.7,42 49.7,41 49.7,38.8 44.7,33.8 v44.7,33.4
  Bottom 0.254: U$5.CLK 50.76,42.06 v50.7,42 | STM32F405RGT6.53 42.85,29.25 44.7,31.1 v44.7,33.4
SDIO_CMD  (via drill 0.3)
  Top 0.254: v45.4,35.5 48.5,38.6 v48.5,38.7
  Bottom 0.254: U$5.MOSI 49.51,39.86 R5.1 49.35,39.55 v48.5,38.7 | STM32F405RGT6.54 43.05,28.75 45.4,31.1 v45.4,35.5
SDIO_D0  (via drill 0.3)
  Top 0.254: v48.5,42.8 46.3,40.6 43.9,40.6 40.3,37 34.5,37 v34.2,36.7
  Bottom 0.254: U$5.MISO 49.71,44.26 R8.1 49.35,43.65 v48.5,42.8 | v34.2,36.7 34.25,36.65 STM32F405RGT6.39
SDIO_D1  (via drill 0.3)
  Top 0.254: v48.5,44.9 46.7,43.1 44.8,43.1 40,38.3 35.4,38.3 v34.9,37.8
  Bottom 0.254: U$5.DNC2 49.99,45.36 R9.1 49.35,45.65 48.6,44.9 v48.5,44.9 | STM32F405RGT6.40 34.75,35.75 34.9,35.9 v34.9,37.8
SDIO_D2  (via drill 0.3)
  Top 0.254: v48.5,34.5 44.8,30.8 v42.8,30.8
  Bottom 0.254: U$5.DNC1 51.51,37.66 R7.1 49.35,35.35 v48.5,34.5 | STM32F405RGT6.51 42.25,30.25 v42.8,30.8
SDIO_D3  (via drill 0.3)
  Top 0.254: v44,31.7 48.5,36.2 v48.5,36.6
  Bottom 0.254: U$5.CS 50.51,38.76 R6.1 49.35,37.45 v48.5,36.6 | STM32F405RGT6.52 42.75,29.75 44,31 v44,31.7
SPI2_CS  (via drill 0.3)
  Top 0.2: U$16.CS 34.8,30.4 33.6,31.6 v31.3,31.6
  Bottom 0.2: v31.3,31.6 31.25,31.65 STM32F405RGT6.33
SPI2_MISO  (via drill 0.3)
  Top 0.2: U$16.MISO 34.8,23.2 34.6,23 33,23 v32.7,23.3
  Bottom 0.2: STM32F405RGT6.35 32.25,32.05 33.2,31.1 33.2,30.6 32.7,30.1 v32.7,23.3
SPI2_MOSI  (via drill 0.3)
  Top 0.2: U$16.MOSI 34,29.6 v33.6,30
  Bottom 0.2: v33.6,30 33.6,31.2 32.75,32.05 STM32F405RGT6.36
SPI2_SCK  (via drill 0.3)
  Top 0.2: U$16.SCK 34.4,30.2 33.7,30.9 v32.5,30.9
  Bottom 0.2: STM32F405RGT6.34 31.75,32.05 32.1,31.7 32.1,31.3 v32.5,30.9
SW
  Bottom 0.254: STM32F405RGT6.60 43.7,25.75 R2.2
SWCLK  (via drill 0.3)
  Top 0.254: v39.1,29.4 46.1,29.4 60.8,44.1 64.2,44.1 64.4,43.9 64.4,43 63.9,42.5 U$2.P$6
  Bottom 0.254: STM32F405RGT6.49 39.15,31.25 38.6,30.7 38.6,29.9 v39.1,29.4
SWDIO  (via drill 0.3)
  Top 0.254: U$2.P$5 64,41.5 64.9,42.4 64.9,44.1 62.2,46.8 49,46.8 46.6,49.2 v43.8,49.2
  Bottom 0.254: v43.8,49.2 37.75,43.15 STM32F405RGT6.46
TIM1_CH4  (via drill 0.3)
  Top 0.254: v37,36 v30.9,36
  Bottom 0.254: STM32F405RGT6.44 36.75,34.25 37,34.5 v37,36 | v30.9,36 30.9,36.05 U$13.1
TIM2_CH1  (via drill 0.3)
  Top 0.254: JP1.7 15.59,30.8 28.1,30.8 30.5,33.2 v39.7,33.2
  Bottom 0.254: STM32F405RGT6.50 41.55,30.75 42,31.2 42,32.7 41.5,33.2 v39.7,33.2 | JP1.8 JP1.7
TIM2_CH2  (via drill 0.3)
  Top 0.254: v36.1,31.1 34.5,32.7 30.7,32.7 28.3,30.3 17.15,30.3 JP1.5
  Bottom 0.254: STM32F405RGT6.55 38.95,28.25 v36.1,31.1 | JP1.6 JP1.5
TIM3_CH1
  Bottom 0.254: U$4.IN1 11.44,13.36 9.4,15.4 9.4,24.5 11.91,27.01 16.79,27.01 17.55,26.25 STM32F405RGT6.22
TIM3_CH2
  Bottom 0.254: U$4.IN2 11.19,12.71 8.7,15.2 8.7,24.4 11.75,27.45 17.35,27.45 18.05,26.75 STM32F405RGT6.23
TIM3_CH3
  Bottom 0.254: U$11.IN1 11.76,43.14 10,44.9 10,48.7 12.5,51.2 20.9,51.2 22.4,49.7 22.4,30.6 24.75,28.25 STM32F405RGT6.26
TIM3_CH4
  Bottom 0.254: U$11.IN2 11.41,42.49 9.3,44.6 9.3,48.8 12.2,51.7 21.2,51.7 22.9,50 22.9,30.9 25.05,28.75 STM32F405RGT6.27
TIM4_CH1
  Bottom 0.254: STM32F405RGT6.58 42.45,26.75 43.2,27.5 45.7,27.5 46.4,26.8 52.6,26.8 54,28.2 55.2,28.2 55.8,28.8 55.8,30.89 JP4.1
TIM4_CH2
  Bottom 0.254: STM32F405RGT6.59 42.65,26.25 43.4,27 45.5,27 46.2,26.3 52,26.3 | 52.2,26.3 52,26.3 | 52,26.3 53.3,26.3 54.1,25.5 58.4,25.5 59.1,26.2 59.1,30.13 JP4.2
TIM4_CH3
  Bottom 0.254: STM32F405RGT6.61 42.15,25.25 42.7,24.7 42.7,13.1 46.3,9.5 53.38,9.5 JP6.3
TIM4_CH4
  Bottom 0.254: STM32F405RGT6.62 41.65,24.75 42.1,24.3 42.1,12.9 46.1,8.9 53.98,8.9 JP6.5
TIM5_CH1
  Bottom 0.254: JP1.2 JP1.1 21.17,17.6 30.5,17.6 32.25,19.35 STM32F405RGT6.14
TIM5_CH2
  Bottom 0.254: JP1.4 JP1.3 23.21,18.1 30.2,18.1 31.75,19.65 STM32F405RGT6.15 31.75,20.85
USART1_RX  (via drill 0.3)
  Top 0.254: U$2.P$3 64,39.5 65.4,40.9 65.4,44.3 58.5,51.2 44.7,51.2 v42.7,49.2
  Bottom 0.254: STM32F405RGT6.43 36.25,42.75 v42.7,49.2
USART1_TX  (via drill 0.3)
  Top 0.254: U$2.P$2 64,38.5 65.9,40.4 65.9,44.5 58.7,51.7 58.1,51.7 57.7,51.7 44.1,51.7 v41.6,49.2
  Bottom 0.254: 41.5,49.1 v41.6,49.2 35.75,43.35 STM32F405RGT6.42
USART2_RX  (via drill 0.3)
  Top 0.254: JP6.6 55.92,9.5 53.9,9.5 52.6,10.8 41,10.8 37.3,14.5 34.1,14.5 v29.8,18.8
  Bottom 0.254: STM32F405RGT6.17 27.7,22.05 27.7,20.9 v29.8,18.8
USART2_TX  (via drill 0.3)
  Top 0.254: JP6.4 55.96,12 49.8,12 48,13.8 40.3,13.8 38.3,15.8 35,15.8 31,19.8 v31,20.4
  Bottom 0.254: STM32F405RGT6.16 31.25,20.65 v31,20.4
USART3_RX  (via drill 0.3)
  Top 0.254: v28.5,21.2 28,20.7 28,11.9 26.1,10 25.82,10 U$1.TX0
  Bottom 0.254: STM32F405RGT6.30 30.55,30.25 31.3,29.5 31.3,23.3 29.2,21.2 v28.5,21.2
USART3_TX  (via drill 0.3)
  Top 0.254: v29.2,22.2 29.2,19.5 29,19.3 29,9.7 26,6.7 25.52,6.7 U$1.RX0
  Bottom 0.254: STM32F405RGT6.29 30.35,29.75 30.8,29.3 30.8,23.8 v29.2,22.2
USART6_RX
  Bottom 0.254: STM32F405RGT6.38 33.75,35.56 U$3.TX_5V
VBAT
  Top 0.254: U$10.PLUS2 38.5,42 31.5,42 U$10.PLUS1 26.7,43.2 24.1,43.2 17.9,37 12.6,37 12.3,36.7 12.3,35.4 10.8,33.9 10.8,23.3 12.6,21.5 12.6,20 13,19.6 16.1,19.6 21.75,13.95 C17.1 23.15,13.95 24.6,12.5 24.92,12.5 U$1.VBAC

### Text on the board
tPlace: M1 | S | V | G | enc | V | M2 | P T | P R | G